# Altium schematic sheet SkipEight.SchDoc
size A4
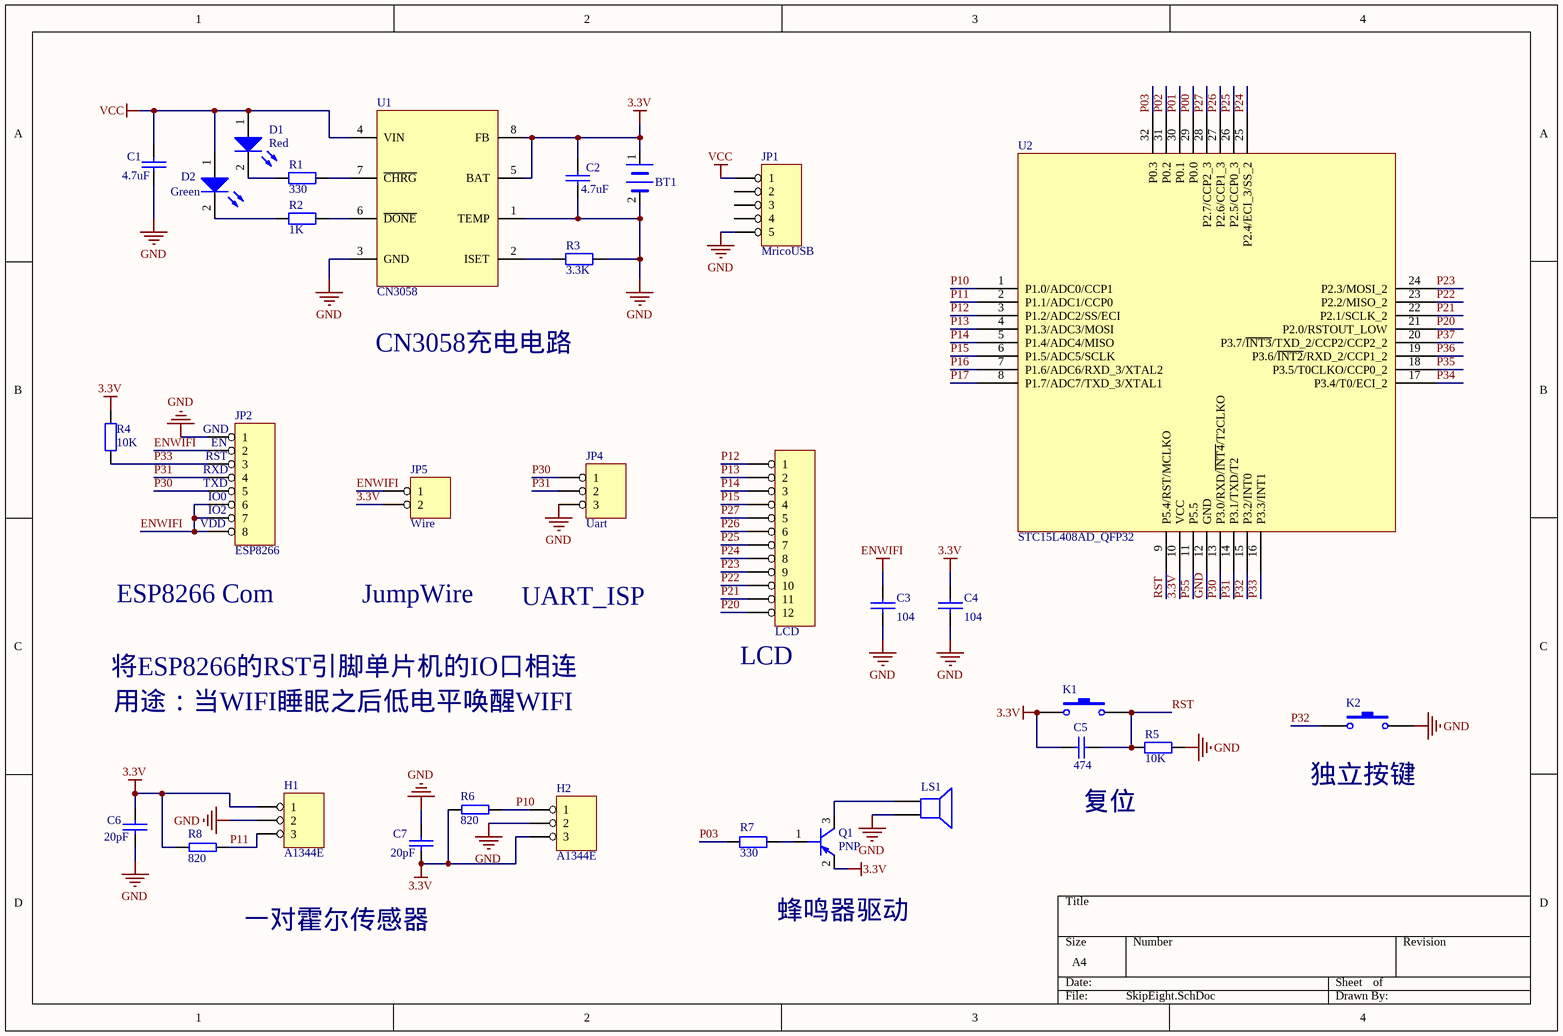
[diagram p0: SkipEight.SchDoc]

## Parts
BT1  BATTERY_1  [AAA Battery]  (value not drawn)
C1  4.7uF  [0805]
C2  4.7uF  [0805]
C3  104  [0603]
C4  104  [0603]
C5  474  [0603]
C6  20pF  [0603]
C7  20pF  [0603]
D1  Red  [0603]
D2  Green  [0603]
H1  A1344E  [A3144]
H2  A1344E  [A3144]
JP1  MricoUSB  [MircoUSB]
JP2  ESP8266  [ESP8266-11]
JP3  LCD  [LCD1621]
JP4  Uart  [SIP3]
JP5  Wire  [SIP2]
K1  Switch1  [KEY-SMT]  (value not drawn)
K2  Switch1  [KEY-SMT]  (value not drawn)
LS1  SPEAKER  [Buzzer-Small]  (value not drawn)
Q1  PNP  [SOT-23]
R1  330  [0603]
R2  1K  [0603]
R3  3.3K  [0603]
R4  10K  [0603]
R5  10K  [0603]
R6  820  [0603]
R7  330  [0603]
R8  820  [0603]
U1  CN3058  [SO-8]
U2  STC15L408AD_QFP32  [LQFP32]

## Nets
3.3V: BT1.1(+) C2.2 C4.2 C5.1 C6.1 C7.2 H1.1 H2.3 JP5.2 K1.1 Q1.2(EMITTER) R4.2 R6.1 R8.1 U1.5(BAT) U1.8(FB) U2.10(VCC)
ENWIFI: C3.2 JP2.2 JP2.6 JP2.7 JP2.8 JP5.1
GND: BT1.2(-) C1.1 C2.1 C3.1 C4.1 C6.2 C7.1 H1.2 H2.2 JP1.5 JP2.1 JP4.3 K2.2 LS1.2 R3.2 R5.2 U1.1(TEMP) U1.3(GND) U2.12(GND)
VCC: C1.2 D1.1(A) D2.1(A) JP1.1 U1.4(VIN)
P00: U2.29(P0.0)
P01: U2.30(P0.1)
P02: U2.31(P0.2)
P03: R7.2 U2.32(P0.3)
P10: H2.1 R6.2 U2.1(P1.0/ADC0/CCP1)
P11: H1.3 R8.2 U2.2(P1.1/ADC1/CCP0)
P12: JP3.1 U2.3(P1.2/ADC2/SS/ECI)
P13: JP3.2 U2.4(P1.3/ADC3/MOSI)
P14: JP3.3 U2.5(P1.4/ADC4/MISO)
P15: JP3.4 U2.6(P1.5/ADC5/SCLK)
P16: U2.7(P1.6/ADC6/RXD_3/XTAL2)
P17: U2.8(P1.7/ADC7/TXD_3/XTAL1)
P20: JP3.12 U2.21(P2.0/RSTOUT_LOW)
P21: JP3.11 U2.22(P2.1/SCLK_2)
P22: JP3.10 U2.23(P2.2/MISO_2)
P23: JP3.9 U2.24(P2.3/MOSI_2)
P24: JP3.8 U2.25(P2.4/ECI_3/SS_2)
P25: JP3.7 U2.26(P2.5/CCP0_3)
P26: JP3.6 U2.27(P2.6/CCP1_3)
P27: JP3.5 U2.28(P2.7/CCP2_3)
P30: JP2.5 JP4.1 U2.13(P3.0/RXD/~{INT4}/T2CLKO)
P31: JP2.4 JP4.2 U2.14(P3.1/TXD/T2)
P32: K2.1 U2.15(P3.2/INT0)
P33: JP2.3 R4.1 U2.16(P3.3/INT1)
P34: U2.17(P3.4/T0/ECI_2)
P35: U2.18(P3.5/T0CLKO/CCP0_2)
P36: U2.19(P3.6/~{INT2}/RXD_2/CCP1_2)
P37: U2.20(P3.7/~{INT3}/TXD_2/CCP2/CCP2_2)
P55: U2.11(P5.5)
RST: C5.2 K1.2 R5.1 U2.9(P5.4/RST/MCLKO)
NetD1_2: D1.2(K) R1.1
NetD2_2: D2.2(K) R2.1
NetLS1_1: LS1.1 Q1.3(COLLECTOR)
NetQ1_1: Q1.1(BASE) R7.1
NetR1_2: R1.2 U1.7(~{CHRG})
NetR2_2: R2.2 U1.6(~{DONE})
NetR3_1: R3.1 U1.2(ISET)

Not connected (* = marked no-connect by the designer): JP1 2 3 4

## Notes on the sheet
- CN3058充电电路
- (near JP2) GND
- (near JP2) EN
- (near JP2) RXD
- (near JP2) TXD
- (near JP2) RST
- (near JP2) IO2
- (near JP2) IO0
- (near JP2) VDD
- (near JP2) ESP8266 Com
- JumpWire
- UART_ISP
- 将ESP8266的RST引脚单片机的IO口相连
- 用途：当WIFI睡眠之后低电平唤醒WIFI
- (near JP3) LCD
- (near K2) 独立按键
- 复位
- 蜂鸣器驱动
- 一对霍尔传感器

## Library data of the parts
BT1 = BATTERY_1: Battery
C1-C4 C6 C7 = CAP1: Value: *
C5 = Cap1: 电容; Value: *
D1 D2 = LED: LED灯
H1 H2 JP4 = HEADER 3
JP1 = HEADER 5
JP2 = HEADER 8
JP3 = HEADER 12
JP5 = HEADER 2
K1 K2 = Switch1: 按键/单刀单掷开关
Q1 = PNP: PNP Transistor
R1-R5 R7 = Res2: 电阻; Value: *
R6 R8 = RES2: Resistor
U2 = STC15F408AD_QFP32
U1 = CN3058: Name: *